# EAGLE design tractor_2v2 (EAGLE 9.0.0)
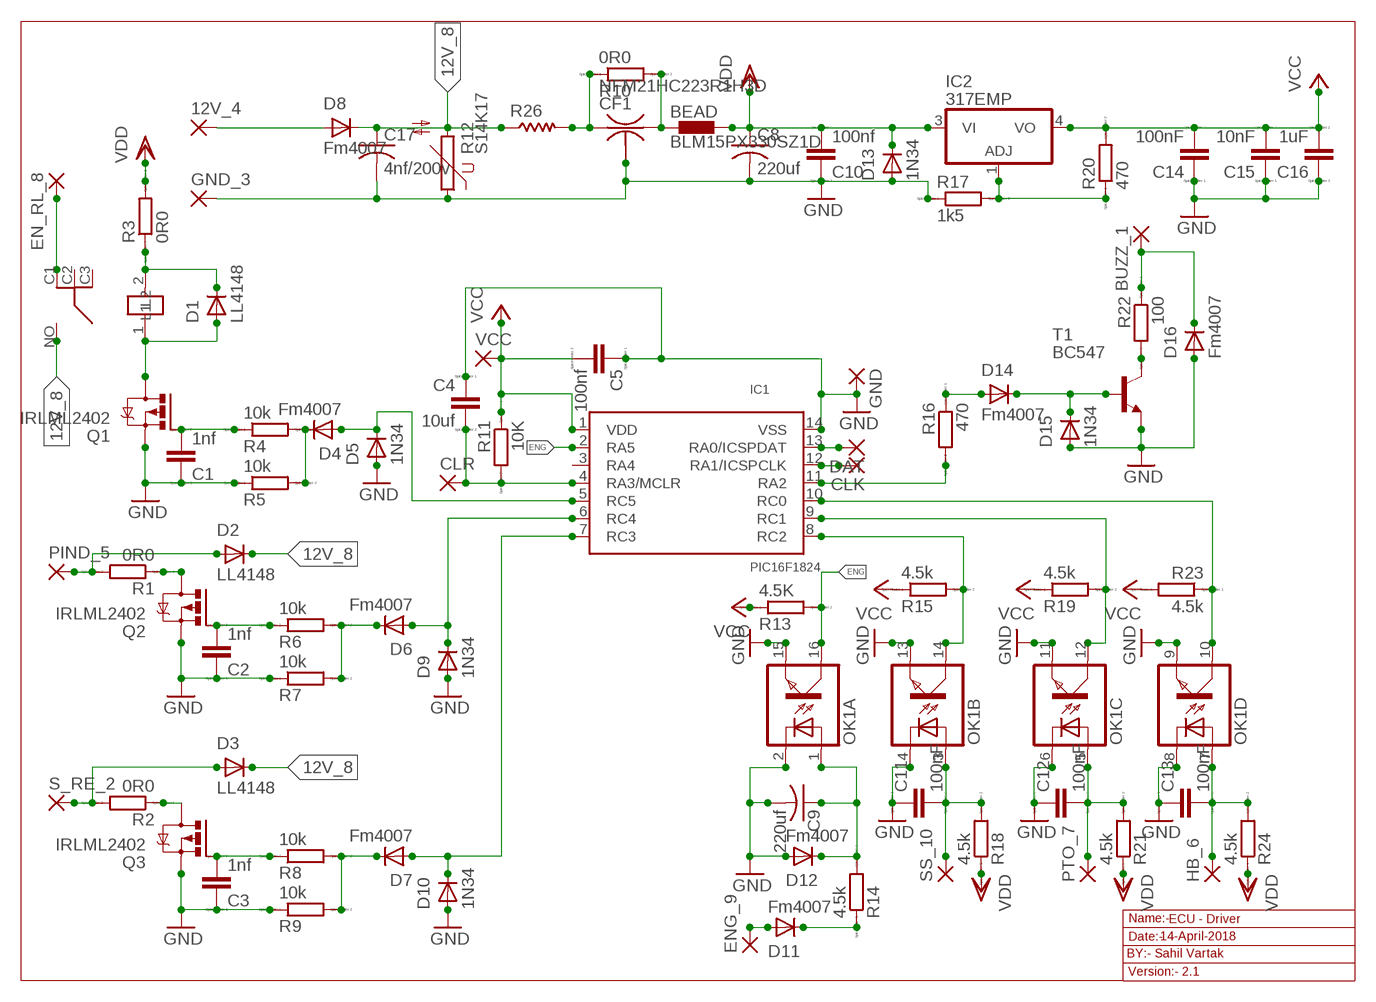
[diagram p0: schematic, sheet 1]

## Parts
12V_4  2,54/1,1  [2,54/1,1]
BEAD  BLM15PX330SZ1D  BLM15HG601SN1  [0402]
BUZZ_1  2,54/1,1  [2,54/1,1]
C1  1nf  CC0603  [C0603]
C2  1nf  CC0603  [C0603]
C3  1nf  CC0603  [C0603]
C4  10uf  CC0603  [C0603]
C5  100nf  CC0603  [C0603]
C8  220uf  C-US025-025X050  [C025-025X050]
C9  220uf  C-US025-025X050  [C025-025X050]
C10  100nf  CC0603  [C0603]
C11  100nF  CC0603  [C0603]
C12  100nF  CC0603  [C0603]
C13  100nF  CC0603  [C0603]
C14  100nF  CC0603  [C0603]
C15  10nF  CC0603  [C0603]
C16  1uF  CC0603  [C0603]
C17  4nf/200v  C-US050-045X075  [C050-045X075]
CF1  NFM21HC223R1H3D  NFM3DC  [NFM3DC]
CLK  1,6/0,8  [1,6/0,8]
CLR  1,6/0,8  [1,6/0,8]
D1  LL4148  GF1  [SMA-DO214AC]
D2  LL4148  GF1  [SMA-DO214AC]
D3  LL4148  GF1  [SMA-DO214AC]
D4  Fm4007  GF1  [SMA-DO214AC]
D5  1N34  GF1  [SMA-DO214AC]
D6  Fm4007  GF1  [SMA-DO214AC]
D7  Fm4007  GF1  [SMA-DO214AC]
D8  Fm4007  GF1  [SMA-DO214AC]
D9  1N34  GF1  [SMA-DO214AC]
D10  1N34  GF1  [SMA-DO214AC]
D11  Fm4007  GF1  [SMA-DO214AC]
D12  Fm4007  GF1  [SMA-DO214AC]
D13  1N34  GF1  [SMA-DO214AC]
D14  Fm4007  GF1  [SMA-DO214AC]
D15  1N34  GF1  [SMA-DO214AC]
D16  Fm4007  GF1  [SMA-DO214AC]
DAT  1,6/0,8  [1,6/0,8]
EN_RL_8  2,54/1,1  [2,54/1,1]
ENG_9  2,54/1,1  [2,54/1,1]
GND  1,6/0,8  [1,6/0,8]
GND_3  2,54/1,1  [2,54/1,1]
HB_6  2,54/1,1  [2,54/1,1]
IC1  PIC16F1824  [SO-14]
IC2  317EMP  [SOT223]
K1  RL703  [RL703]
OK1  TLP283-4  [MINI-FLAT-16]
PIND_5  2,54/1,1  [2,54/1,1]
PTO_7  2,54/1,1  [2,54/1,1]
Q1  IRLML2402  IRLML5203  [MICRO3]
Q2  IRLML2402  IRLML5203  [MICRO3]
Q3  IRLML2402  IRLML5203  [MICRO3]
R1  0R0  RR0603  [R0603]
R2  0R0  RR0603  [R0603]
R3  0R0  RR0603  [R0603]
R4  10k  RR0603  [R0603]
R5  10k  RR0603  [R0603]
R6  10k  RR0603  [R0603]
R7  10k  RR0603  [R0603]
R8  10k  RR0603  [R0603]
R9  10k  RR0603  [R0603]
R10  0R0  RR0603  [R0603]
R11  10K  RR0603  [R0603]
R12  S14K17  [S14K17]
R13  4.5K  RR0603  [R0603]
R14  4.5k  RR0603  [R0603]
R15  4.5k  RR0603  [R0603]
R16  470  RR0603  [R0603]
R17  1k5  RR0603  [R0603]
R18  4.5k  RR0603  [R0603]
R19  4.5k  RR0603  [R0603]
R20  470  RR0603  [R0603]
R21  4.5k  RR0603  [R0603]
R22  100  RR0603  [R0603]
R23  4.5k  RR0603  [R0603]
R24  4.5k  RR0603  [R0603]
R26  R-US_WSC2515  [WSC2515]
S_RE_2  2,54/1,1  [2,54/1,1]
SS_10  2,54/1,1  [2,54/1,1]
T1  BC547  [TO92]
VCC  1,6/0,8  [1,6/0,8]

## Nets
12V_8: C17.1 D2.K(C) D3.K(C) D8.K(C) K1.NO R12.2 R26.1
BUZZ_4: BUZZ_1.1(P) D16.K(C) R22.1
ENG: IC1.2(RA5) OK1.16(A:COL) R13.2
GND: C1.1 C2.1 C3.1 C4.1 C5.1 C8.2 C9.2 C10.1 C11.1 C12.1 C13.1 C14.1 C15.1 C16.1 C17.2 CF1.2@1 D5.A D9.A D10.A D12.A D13.A D15.A D16.A GND.1(P) GND_3.1(P) IC1.14(VSS) OK1.2(A:C) OK1.4(B:C) OK1.6(C:C) OK1.8(D:C) OK1.9(D:EMIT) OK1.11(C:EMIT) OK1.13(B:EMIT) OK1.15(A:EMIT) Q1.2(S) Q2.2(S) Q3.2(S) R5.1 R7.1 R9.1 R12.1 R17.1 T1.1(E)
N$1: D11.K(C) R14.1
N$3: IC1.10(RC0) OK1.10(D:COL) R23.1
N$5: D1.A K1.1(L2) Q1.3(D)
N$6: C2.2 Q2.1(G) R6.1
N$7: CF1.1 R10.1 R26.2
N$8: DAT.1(P) IC1.13(RA0/ICSPDAT)
N$9: CLK.1(P) IC1.12(RA1/ICSPCLK)
N$13: D1.K(C) K1.2(L1) R3.1
N$14: IC2.1(ADJ) R17.2 R20.1
N$15: BEAD.1 CF1.3 R10.2
N$16: D14.A R16.1
N$17: D4.A D5.K(C) IC1.5(RC5)
N$18: C3.2 Q3.1(G) R8.1
N$19: D7.K(C) R8.2 R9.2
N$20: IC1.11(RA2) R16.2
N$21: Q3.3(D) R2.1
N$22: D11.A ENG_9.1(P)
N$23: C9.1 D12.K(C) OK1.1(A:A) R14.2
N$24: D6.K(C) R6.2 R7.2
N$25: D2.A PIND_5.1(P) R1.2
N$26: D6.A D9.K(C) IC1.6(RC4)
N$27: D3.A R2.2 S_RE_2.1(P)
N$28: Q2.3(D) R1.1
N$29: 12V_4.1(P) D8.A
N$32: D7.A D10.K(C) IC1.7(RC3)
N$72: C1.2 Q1.1(G) R4.1
N$74: D4.K(C) R4.2 R5.2
N$78: C11.2 OK1.3(B:A) R18.2 SS_10.1(P)
N$80: C12.2 OK1.5(C:A) PTO_7.1(P) R21.2
N$82: C13.2 HB_6.1(P) OK1.7(D:A) R24.2
N$84: IC1.9(RC1) OK1.12(C:COL) R19.2
N$85: IC1.8(RC2) OK1.14(B:COL) R15.2
N$87: C4.2 CLR.1(P) IC1.4(RA3/MCLR) R11.2
N$89: D14.K(C) D15.K(C) T1.2(B)
N$90: R22.2 T1.3(C)
R_3: EN_RL_8.1(P) K1.C1
VCC: C5.2 C14.2 C15.2 C16.2 IC1.1(VDD) IC2.4(VO) R11.1 R13.1 R15.1 R19.1 R20.2 R23.2 VCC.1(P)
VDD: BEAD.2 C8.1 C10.2 D13.K(C) IC2.3(VI) R3.2 R18.1 R21.1 R24.1
Unconnected: CF1.2@2 IC1.3(RA4) K1.C2 K1.C3

## Notes on the sheet
- Name:- | ECU - Driver
- Date:- | 14-April-2018
- BY:- Sahil Vartak
- Version:- 2.1

## Library data of the parts
12V_4 BUZZ_1 EN_RL_8 ENG_9 GND_3 HB_6 PIND_5 PTO_7 S_RE_2 SS_10 = wirepad:2,54/1,1: THROUGH-HOLE PAD
BEAD = inductors:BLM15H: EMIFIL (R) Chip Ferrite Bead for GHz Noise Source: http://www.murata.com/ Ferrite Bead BLM15H.pdf
C1-C5 C10-C16 = eagle-ltspice:C: CAPACITOR, European symbol; SPICEMODEL: NONE; SPICEPREFIX: C
C8 C9 C17 = rcl:C-US: CAPACITOR, American symbol
CF1 = murata-filter:NFM: EMIFIL(R) (Capacitor type) Single Circuit Type for Signal Lines Source: http://search.murata.co.jp/Ceramy/image/img/PDF/ENG/L0111S0109NFM3DC.pdf; MF: FARNELL; MPN: NFM3DCC470U1H3L; OC_FARNELL: 9528288; OC_NEWARK: 38K6023
CLK CLR DAT GND VCC = wirepad:1,6/0,8: THROUGH-HOLE PAD
D1-D16 = diode:GF1: DIODE
IC1 = microchip:PIC16F1824
IC2 = lm317:*317: Positive VOLTAGE REGULATOR
K1 = relay:RL703
OK1 = optocoupler:TLP283-4: TOSHIBA PHOTOCOUPLER GaAs IRED & PHOTO-TRANSISTOR Source: http://www.semicon.toshiba.co.jp/td/en/Opto/Photocoupler/en_20050928_TLP283_datasheet.pdf; OC_FARNELL: unknown; OC_NEWARK: unknown
Q1-Q3 = transistor-power:IRLML5203: HEXFET P-Channel Power MOSFET
R1-R11 R13-R24 = eagle-ltspice:R: RESISTOR, European symbol; SPICEMODEL: NONE; SPICEPREFIX: R
R12 = varistor:S14K17: VARISTOR
R26 = resistor:R-US_: RESISTOR, American symbol
T1 = transistor-neu-to92:BC547: NPN TRANSISTOR

## Board
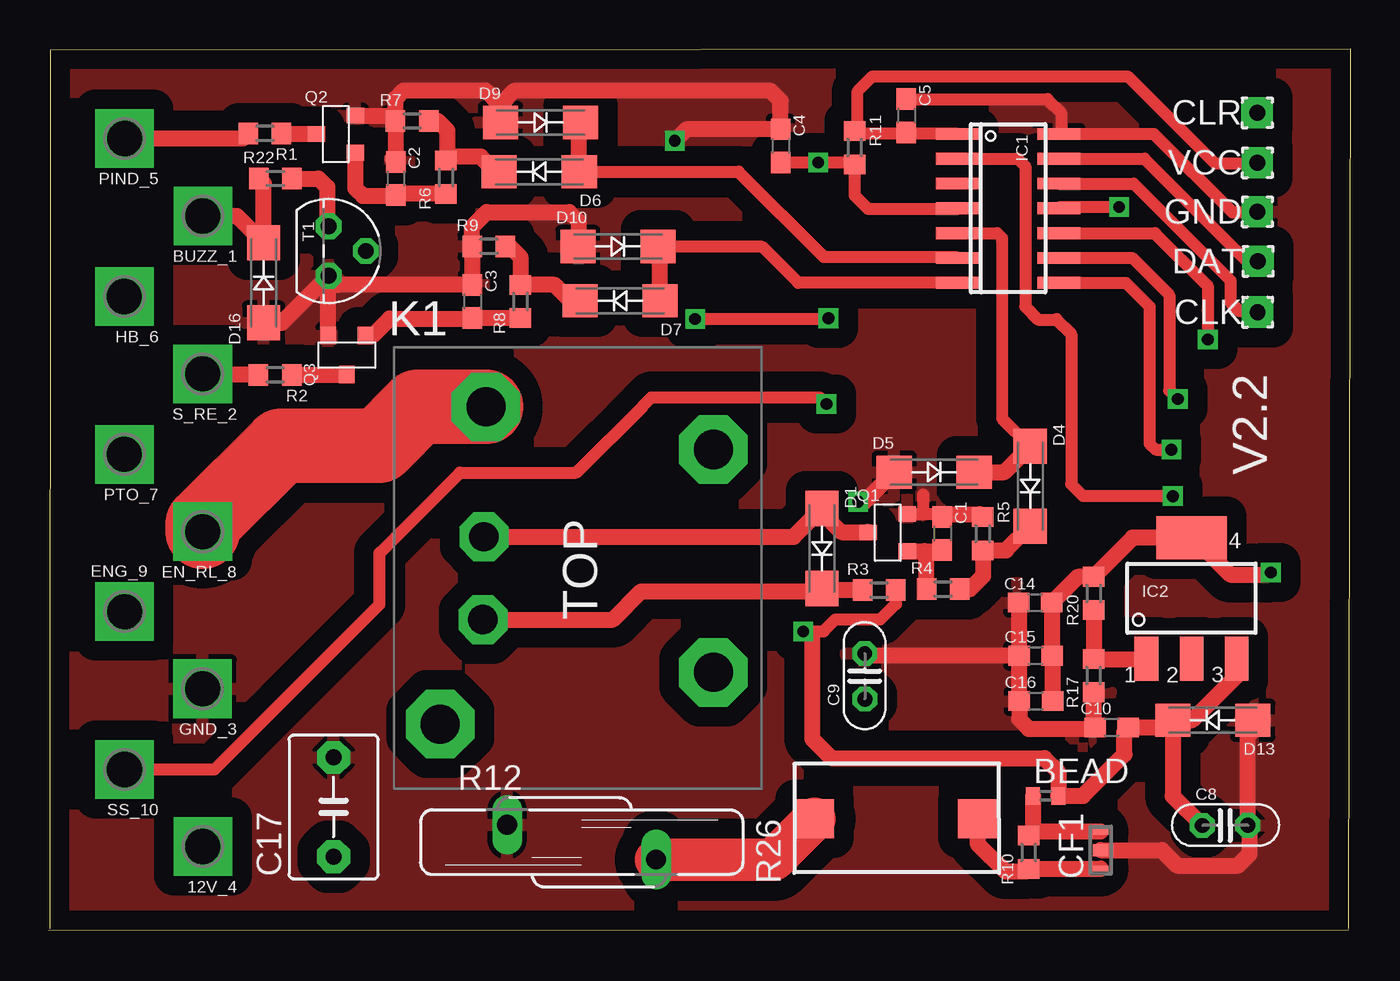
[diagram p1: board, top side]
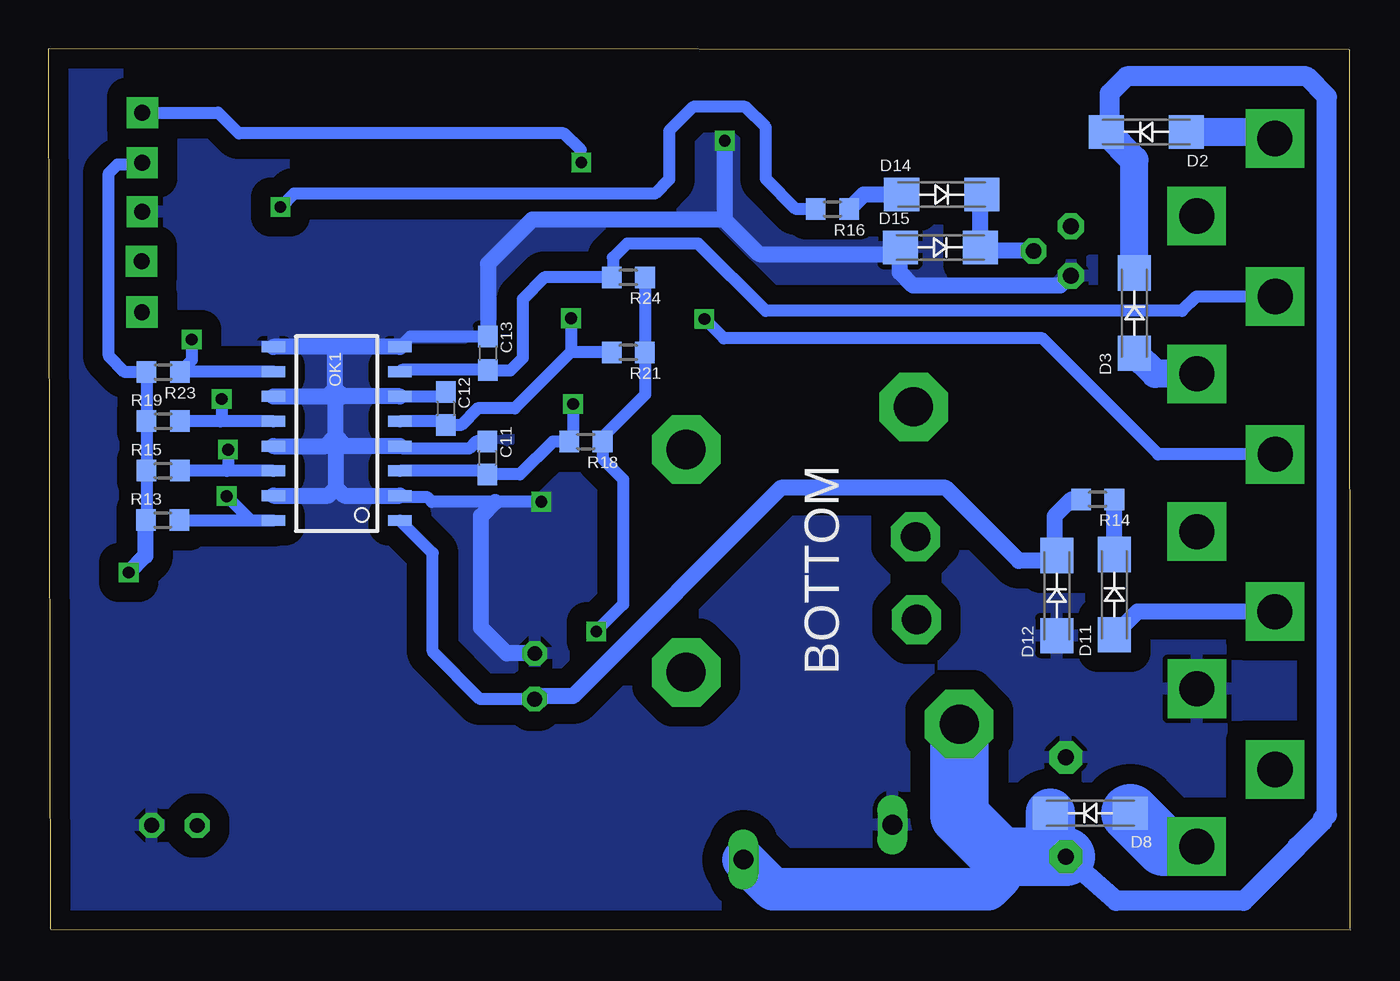
[diagram p2: board, bottom side, seen from below]

Size 66.66 x 45.12 mm. Coordinates in mm from the lower left corner, seen from the top.
Outline: 0.08,45.08 0.04,0.07
Outline: 66.57,0.08 66.66,45.12
Outline: 0.09,45.08 66.65,45.11
Outline: 0,0 66.56,0.03
Copper layers (1*16): Top 0.035mm / dielectric 1.5mm / Bottom 0.035mm
Design rules "default": minimum track width 10mil, minimum drill 24mil, track to track 8mil, track to pad 8mil, pad to pad 8mil, via to via 8mil, smd to smd 8mil, copper to edge 40mil, drill to drill 8mil, minimum pad ring 10mil, minimum via ring 8mil, stop-mask expansion 4mil, vias tented up to drill 0mil, thermal gap 10mil

### Footprints (pad centres in the part's own frame; a part is rotated, then mirrored left to right if it is on the bottom)
2,54/1,1 = drill 1.8 pad 3 square: 1 0,0
0402 = smd 0.7 x 0.9: 1 -0.65,0; 2 0.65,0
C0603 = smd 1.1 x 1: 1 -0.85,0; 2 0.85,0
C025-025X050 = drill 0.762 pad 1.27 octagon: 1 -1.176,-0.006; 2 1.159,0.007
C050-045X075 = drill 0.813 pad 1.676 octagon: 1 -2.54,0; 2 2.54,0
NFM3DC = smd 0.3 x 0.8: 1 -0.95,0; 3 0.95,0 | smd 0.6 x 0.8: 2@1 0,0; 2@2 0,0
1,6/0,8 = drill 0.813 pad 1.6 square: 1 0,0
SMA-DO214AC = smd 1.8 x 1.7: A -2.05,0; K 2.05,0
SO-14 = smd 0.6 x 2.2: 1 -3.81,-2.6; 2 -2.54,-2.6; 3 -1.27,-2.6; 4 0,-2.6; 5 1.27,-2.6; 6 2.54,-2.6; 7 3.81,-2.6; 8 3.81,2.6; 9 2.54,2.6; 10 1.27,2.6; 11 0,2.6; 12 -1.27,2.6; 13 -2.54,2.6; 14 -3.81,2.6
SOT223 = smd 1.219 x 2.235: 1 -2.311,-3.099; 2 0,-3.099; 3 2.311,-3.099 | smd 3.6 x 2.2: 4 0,3.099
RL703 = drill 1.5 pad 2.5 octagon: 1 1.73,-5.643; 2 -2.51,-5.693 | drill 2 pad 3.5 octagon: C1 8.38,-5.543; C2 6.2,6.107; C3 -5.21,6.107; NO -7.86,-7.883
MINI-FLAT-16 = smd 1.2 x 0.56: 1 -3.24,4.445; 2 -3.24,3.175; 3 -3.24,1.905; 4 -3.24,0.635; 5 -3.24,-0.635; 6 -3.24,-1.905; 7 -3.24,-3.175; 8 -3.24,-4.445; 9 3.24,-4.445; 10 3.24,-3.175; 11 3.24,-1.905; 12 3.24,-0.635; 13 3.24,0.635; 14 3.24,1.905; 15 3.24,3.175; 16 3.24,4.445
MICRO3 = smd 0.8 x 0.9: 1 -0.95,-1; 2 0.95,-1; 3 0,1
R0603 = smd 1 x 1.1: 1 -0.85,0; 2 0.85,0
S14K17 = drill 1.016 long: 1 -0.889,-3.81; 2 0.889,3.81
WSC2515 = smd 2 x 2: 1 -4.075,-0.1; 2 4.275,-0.1
TO92 = drill 0.813 octagon: 1 1.27,0; 2 0,1.905; 3 -1.27,0

### Placement (x,y rotation side)
12V_4  7.88,4.29 180 top
BEAD  51.04,6.88 0 top
BUZZ_1  7.88,36.56 180 top
C1  45.75,20.31 270 top
C2  17.76,38.48 270 top
C3  21.69,32.18 270 top
C4  37.47,40.15 270 top
C5  43.91,41.69 270 top
C8  60.23,5.37 0 top
C9  41.78,13.01 90 top
C10  54.41,10.38 0 top
C11  44.2,24.18 270 bottom
C12  46.34,26.7 270 bottom
C13  44.18,29.54 270 bottom
C14  50.51,16.77 0 top
C15  50.53,14.05 0 top
C16  50.54,11.73 0 top
C17  14.58,6.31 90 top
CF1  53.86,4.1 90 top
CLK  61.89,31.64 90 top
CLR  61.87,41.85 90 top
D1  39.58,19.54 270 top
D2  10.46,40.86 180 bottom
D3  11.07,31.59 90 bottom
D4  50.25,22.73 270 top
D5  45.33,23.45 0 top
D6  25.11,38.83 180 top
D7  29.25,32.22 180 top
D8  13.33,6 180 bottom
D9  25.18,41.35 0 top
D10  29.14,35 0 top
D11  12.1,17.18 90 bottom
D12  15.05,17.13 90 bottom
D13  59.6,10.76 180 top
D14  20.94,37.66 0 bottom
D15  21.01,34.95 0 bottom
D16  11,33.14 90 top
DAT  61.91,34.24 90 top
EN_RL_8  7.88,20.4 180 top
ENG_9  3.88,16.31 0 top
GND  61.88,36.78 90 top
GND_3  7.87,12.36 180 top
HB_6  3.87,32.44 180 top
IC1  49.12,36.95 270 top
IC2  58.51,16.99 0 top
K1  27.92,18.41 90 bottom
OK1  51.91,25.42 180 bottom
PIND_5  3.88,40.53 180 top
PTO_7  3.87,24.36 180 top
Q1  42.96,20.35 90 top
Q2  14.69,40.75 90 top
Q3  15.26,29.44 180 top
R1  11.06,40.79 180 top
R2  11.59,28.43 180 top
R3  42.52,17.41 0 top
R4  45.8,17.46 0 top
R5  47.82,20.29 270 top
R6  20.34,38.54 90 top
R7  18.6,41.42 0 top
R8  24.15,32.18 90 top
R9  22.53,35.01 0 top
R10  50.17,3.99 90 top
R11  41.26,40.06 270 top
R12  27.28,4.51 270 top
R13  60.83,21 0 bottom
R14  12.95,22.06 180 bottom
R15  60.81,23.52 0 bottom
R16  26.53,36.91 180 bottom
R17  53.49,13.03 90 top
R18  39.16,25.01 180 bottom
R19  60.8,26.06 0 bottom
R20  53.5,17.24 90 top
R21  36.99,29.58 180 bottom
R22  11.6,38.48 0 top
R23  60.8,28.57 180 bottom
R24  36.98,33.42 180 bottom
R26  43.28,5.81 0 top
S_RE_2  7.88,28.48 180 top
SS_10  3.88,8.23 180 top
T1  14.33,34.77 270 top
VCC  61.88,39.29 90 top

### Tracks (layer width: path | path; a pad name or v marks a point on that pad's centre or on a via)
12V_8
  Top 2.184: R12.2 37.12,3.62 R26.1
  Bottom 1.016: D2.K 12.35,41.02 12.35,42.82 11.47,43.7 2.26,43.7 1.22,42.66 1.22,5.91 1.44,5.69 1.44,5.58 2.73,4.29 2.73,4.26 5.48,1.51 12.02,1.51 C17.1
  Bottom 1.422: 12.45,40.92 D2.K 11.07,39.42 D3.K
  Bottom 2.184: C17.1 14.74,3.57 | 18.58,2.11 29.58,2.11 R12.2
  Bottom 2.188: 18.58,2.11 17.94,2.75 17.94,3.77
  Bottom 2.54: C17.1 15.38,4.57 D8.K
  Bottom 3: C17.1 17.94,3.77 20.04,5.87 K1.NO
BUZZ_4
  Top 0.813: R22.1 11,38.23 D16.K 9.63,36.56 BUZZ_1.1
ENG  (via drill 0.6)
  Top 0.61: v57.55,22.22 52.96,22.22 52.35,22.83 52.35,30.53 51.6,31.28 51.58,31.26 50.65,31.26 49.99,31.92 49.99,39.11 49.61,39.49 IC1.2
  Bottom 0.61: 56.3,20.97 59.96,20.97 R13.2 | OK1.16 56.3,20.97 | 56.3,20.97 v57.55,22.22
GND  (via drill 0.6)
  Top 0.61: C5.1 51.14,42.54 51.84,41.84 51.84,40.88 IC1.14 56.59,40.76 60.61,36.74 61.84,36.74 GND.1 | 45.6,21.3 Q1.2 44.77,21.3 44.78,21.31 44.78,22.31
  Top 0.813: C1.1 45.6,21.3 47.66,21.3 R5.1 | 17.58,39.51 C2.1 R7.1 | R7.1 17.75,42.57 18.17,42.99 22.35,42.99 23.1,42.24 | 23.1,42.24 23.1,41.62 D9.A | 27.12,35.03 27.12,36.28 26.64,36.76 22.42,36.76 21.68,36.02 R9.1 C3.1 14.8,33.03 T1.1 | Q2.2 17.47,41.7 R7.1 | D16.A 11.92,31.09 T1.1 | Q3.2 14.31,33.48 T1.1 | 23.1,42.24 23.83,42.97 36.95,42.97 37.47,42.45 C4.1 32.64,41 v32.05,40.41 | v41.44,21.93 41.76,21.93 D5.A | D13.A 62.18,10.76 61.39,9.96 C8.2 61.48,5.29 61.48,3.91 60.88,3.31 57.78,3.31 56.99,4.1 CF1.2@1 | C15.1 C16.1 49.69,10.8 50.18,10.31 53.49,10.31 C10.1 53.49,10.45 R17.1 | C15.1 41.89,14.05 C9.2 | 49.68,16.75 C14.1 49.69,16.74 C15.1
  Bottom 0.61: C11.1 44.77,25.03 45.15,24.65 48.54,24.65 OK1.4 | OK1.6 46.57,27.32 C12.1 | C13.1 48.15,30.39 OK1.8 | v41.44,21.93 43.8,21.93 47.04,21.93 47.29,22.18 48.61,22.18 OK1.2
  Bottom 0.813: OK1.8 51.82,29.86 | 51.82,29.86 OK1.9 | OK1.6 51.59,27.32 51.96,27.69 | 51.99,27.72 51.99,29.69 51.82,29.86 | OK1.4 51.46,24.78 51.79,25.11 | 51.79,25.11 51.79,25.13 51.96,25.3 | 51.96,25.3 51.96,27.69 | 51.96,27.69 51.99,27.72 | 51.94,22.65 51.53,22.24 OK1.2 | 51.94,22.65 51.94,24.96 51.79,25.11 | OK1.15 52.35,22.24 51.94,22.65 | OK1.13 52.48,24.78 51.96,25.3 | OK1.11 52.39,27.32 51.99,27.72 | v32.05,40.41 32.05,36.37 | 32.05,36.37 30.29,34.61 23.4,34.61 D15.A 23.08,34.93 23.08,33.67 22.41,33 14.88,33 14.38,33.5 T1.1 14.21,33.38 | 44.18,30.57 C13.1 44.17,34.11 41.91,36.37 32.05,36.37 | C9.2 43.21,14.17 44.53,15.49 44.53,21.2 43.8,21.93
  pour Bottom (isolate 1.016): -0.03,45.13 66.78,45.13 66.78,-0.04 -0.03,-0.04
  pour Top (isolate 1.016): 0.01,45.13 66.8,45.13 66.8,0.02 0.01,0.02
N$1
  Bottom 0.813: D11.K R14.1
N$3  (via drill 0.6)
  Top 0.61: IC1.10 56.64,35.68 59.33,32.99 59.33,31.75 v59.34,30.24
  Bottom 0.61: OK1.10 59.93,28.59 R23.1 59.34,29.18 v59.34,30.24
N$5
  Top 0.813: Q1.3 41.93,20.38 40.59,20.38 39.58,21.39 D1.A 38.13,20.14 K1.1
N$6
  Top 0.813: R6.1 17.82,37.69 C2.2 17.72,37.59 16.08,37.59 15.69,37.98 Q2.1
N$7
  Top 0.813: R26.2 47.55,4.44 48.98,3.01 50.04,3.01 R10.1 CF1.1
N$8
  Top 0.61: IC1.13 56.1,39.49 61.37,34.22 61.89,34.22 DAT.1
N$9
  Top 0.61: IC1.12 55.55,38.22 60.5,33.27 60.5,32.15 60.95,31.7 61.83,31.7 CLK.1
N$13
  Top 0.813: R3.1 39.67,17.41 D1.K 39.44,17.35 30.33,17.35 28.88,15.9 K1.2
N$14
  Top 0.813: R20.1 53.5,13.89 R17.2 56.18,13.88 IC2.1
N$15
  Top 0.813: CF1.3 50.38,5.05 R10.2 50.39,5.06 BEAD.1
N$16
  Bottom 0.813: D14.A 24.93,37.66 R16.1
N$17
  Top 0.61: IC1.5 48.56,35.68 48.81,35.43 48.81,26.22 D4.A
  Top 0.813: D5.K 48.92,23.45 D4.A
N$18
  Top 0.813: R8.1 C3.2 21.67,31.31 17.44,31.31 16.57,30.44 Q3.1
N$19
  Top 0.813: R9.2 23.6,35.01 24.15,34.46 R8.2 25.9,33.04 26.72,32.22 D7.K
N$20  (via drill 0.6)
  Top 0.61: v54.8,37.02 51.79,37.02 IC1.11
  Bottom 0.61: R16.2 28.39,36.91 29.95,38.47 29.95,41.1 31,42.15 33.67,42.15 34.9,40.92 34.9,38.43 35.63,37.7 54.12,37.7 v54.8,37.02
N$21
  Top 0.813: R2.1 Q3.3
N$22
  Bottom 0.813: ENG_9.1 10.92,16.31 D11.A
N$23
  Bottom 0.61: C9.1 44.56,11.83 47,14.27 47,19.3 OK1.1
  Bottom 0.813: R14.2 14.29,22.06 15.16,21.19 15.16,19.29 D12.K 15.05,18.91 17,18.91 20.73,22.64 29.17,22.64 39.82,11.99 41.63,11.99 C9.1
N$24
  Top 0.813: R7.2 19.92,41.42 20.4,40.94 20.4,39.45 R6.2 20.55,39.6 22.11,39.6 22.88,38.83 D6.K
N$25
  Top 0.813: PIND_5.1 9.95,40.53 R1.2
  Bottom 1.422: D2.A 4.21,40.86 PIND_5.1
N$26
  Top 0.61: D6.A 35.32,38.83 39.68,34.47 46.47,34.47 IC1.6
  Top 0.813: D6.A 27.16,41.58 D9.K
N$27
  Top 0.813: R2.2 7.93,28.43 S_RE_2.1
  Bottom 1.422: S_RE_2.1 10.01,28.48 D3.A
N$28
  Top 0.813: Q2.3 11.95,40.75 R1.1
N$29
  Bottom 3: 12V_4.1 9.57,4.29 D8.A
N$32
  Top 0.61: IC1.7 38.38,33.14 36.54,34.98 31.21,34.98 D10.K
  Top 0.813: D7.A 31.3,34.89 D10.K
N$72
  Top 0.813: Q1.1 44.85,19.4 | 44.85,19.4 45.58,19.4 C1.2 | R4.1 44.95,19.31 44.85,19.4
N$74
  Top 0.813: R4.2 47.17,17.46 47.85,18.14 47.85,19.37 R5.2 49.01,19.45 D4.K
N$78  (via drill 0.6)
  Top 0.61: SS_10.1 8.48,8.23 16.93,16.68 16.93,19.3 21.05,23.42 27,23.42 30.44,26.86 30.44,26.87 30.85,27.28 39.48,27.28 v39.82,26.94
  Bottom 0.61: OK1.3 44.38,23.51 C11.2 42.53,23.33 40.85,25.01 R18.2 39.82,25.2 v39.82,26.94
  Bottom 0.813: 44.11,23.24 C11.2
N$80  (via drill 0.6)
  Top 0.61: v33.09,31.29 39.88,31.29 v39.92,31.33
  Bottom 0.61: OK1.5 46.54,26.05 C12.2 45.56,25.86 44.71,26.71 42.81,26.71 39.94,29.58 | R21.2 39.94,29.58 | PTO_7.1 9.85,24.36 15.78,30.29 32.09,30.29 v33.09,31.29 | v39.92,31.33 39.92,29.6 39.94,29.58
N$82
  Bottom 0.61: HB_6.1 7.9,32.44 8.64,31.7 29.96,31.7 33.41,35.15 37.05,35.15 37.77,34.43 37.77,33.48 R24.2 41.29,33.42 42.4,32.31 42.4,29.28 43.04,28.64 44.13,28.64 C13.2 48.58,28.69 OK1.7
N$84  (via drill 0.6)
  Top 0.61: IC1.9 55.47,34.41 57.36,32.52 57.36,27.64 v57.81,27.19
  Bottom 0.61: OK1.12 57.88,26.05 | 57.88,26.05 R19.2 | v57.81,27.19 57.81,26.12 57.88,26.05
N$85  (via drill 0.6)
  Top 0.61: IC1.8 55.15,33.14 56.36,31.93 56.36,24.91 56.67,24.6 v57.48,24.6
  Bottom 0.61: OK1.14 57.55,23.51 | 57.55,23.51 59.95,23.51 R15.2 | v57.48,24.6 57.48,23.58 57.55,23.51
N$87  (via drill 0.6)
  Top 0.61: C4.2 v39.4,39.3 41.17,39.3 R11.2 41.26,37.62 41.95,36.93 46.5,36.93 IC1.4
  Bottom 0.61: v39.4,39.3 39.43,39.33 39.43,39.94 39.44,39.94 40.29,40.79 56.93,40.79 57.99,41.85 CLR.1
N$89
  Bottom 0.813: T1.2 18.78,34.77 D15.K 18.96,37.59 D14.K
N$90
  Top 0.813: R22.2 13.81,38.48 14.25,38.04 14.25,36.12 T1.3
R_3
  Top 3.81: EN_RL_8.1 7.88,20.8 11.89,24.81 16.9,24.81 18.89,26.8 22.37,26.8 K1.C1
VCC  (via drill 0.6)
  Top 0.61: IC1.1 43.99,40.76 C5.2 43.82,40.76 41.41,40.76 | 41.41,40.76 41.41,42.94 42.18,43.71 55.24,43.71 59.69,39.26 61.85,39.26 VCC.1 | 41.41,40.76 R11.1
  Top 0.813: v62.57,18.31 62.47,18.21 60.5,18.21 58.62,20.09 IC2.4 55.5,20.09 R20.2 52.68,18.09 C14.2 51.36,14.07 C15.2 C16.2
  Bottom 0.61: R23.2 R19.1 | R19.1 | R19.1 R15.1 61.66,21.02 R13.1 61.72,21.04 | 61.69,28.53 R23.2 | R23.2 62.76,28.57 63.59,29.4 63.59,38.75 63.14,39.2 61.97,39.2 VCC.1
  Bottom 0.813: 61.72,21.04 61.72,19.16 v62.57,18.31
VDD  (via drill 0.6)
  Top 0.61: R3.2 43.38,16.71 42.58,15.91 40.28,15.91 39.67,15.3 v38.63,15.3 39.08,14.85 | 51.58,6.99 BEAD.2
  Top 0.813: 43.4,17.38 R3.2 | D13.K 57.17,10.38 C10.2 55.08,10.2 55.08,9.01 52.95,6.88 BEAD.2 | D13.K 58.55,10.76 60.88,13.09 60.88,13.83 IC2.3 | 51.78,6.97 BEAD.2 | D13.K 57.55,6.87 C8.1 | 39.08,14.85 39.08,9.81 40.08,8.81 50.98,8.81 51.68,8.11 BEAD.2
  Bottom 0.61: R24.1 R21.1 36.11,29.55 36.11,27.43 38.3,25.23 R18.1 38.3,24.14 37.25,23.08 37.25,16.68 v38.63,15.3

### Text on the board
tNames: V2.2 | TOP
bNames: BOTTOM